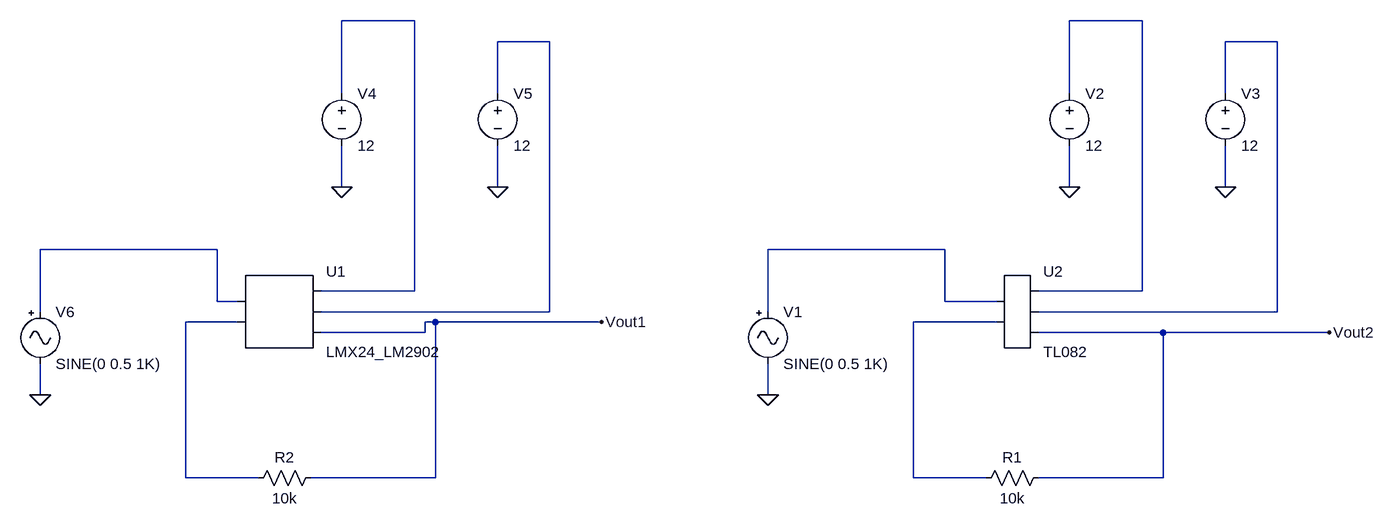
[diagram p0: schematic SimulacaoRelatorio1Parte1.asc]
SimulacaoRelatorio1Parte1.asc, the LTspice schematic file:
Version 4
SHEET 1 1764 680
WIRE 272 -384 160 -384
WIRE 1392 -384 1280 -384
WIRE 480 -352 400 -352
WIRE 1600 -352 1520 -352
WIRE 160 -272 160 -384
WIRE 400 -272 400 -352
WIRE 1280 -272 1280 -384
WIRE 1520 -272 1520 -352
WIRE 160 -128 160 -192
WIRE 400 -128 400 -192
WIRE 1280 -128 1280 -192
WIRE 1520 -128 1520 -192
WIRE -32 -32 -304 -32
WIRE 1088 -32 816 -32
WIRE 272 32 272 -384
WIRE 272 32 128 32
WIRE 1392 32 1392 -384
WIRE 1392 32 1232 32
WIRE -32 48 -32 -32
WIRE 0 48 -32 48
WIRE 1088 48 1088 -32
WIRE 1168 48 1088 48
WIRE -304 64 -304 -32
WIRE 480 64 480 -352
WIRE 480 64 128 64
WIRE 816 64 816 -32
WIRE 1600 64 1600 -352
WIRE 1600 64 1232 64
WIRE 0 80 -80 80
WIRE 304 80 288 80
WIRE 560 80 304 80
WIRE 1168 80 1040 80
WIRE 288 96 288 80
WIRE 288 96 128 96
WIRE 1424 96 1232 96
WIRE 1680 96 1424 96
WIRE -304 192 -304 144
WIRE 816 192 816 144
WIRE -80 320 -80 80
WIRE 32 320 -80 320
WIRE 304 320 304 80
WIRE 304 320 112 320
WIRE 1040 320 1040 80
WIRE 1152 320 1040 320
WIRE 1424 320 1424 96
WIRE 1424 320 1232 320
FLAG -304 192 0
FLAG 400 -128 0
FLAG 160 -128 0
FLAG 560 80 Vout1
FLAG 816 192 0
FLAG 1520 -128 0
FLAG 1280 -128 0
FLAG 1680 96 Vout2
SYMBOL AutoGenerated\\LMX24_LM2902 64 64 R0
SYMATTR InstName U1
SYMBOL voltage 160 -288 R0
SYMATTR InstName V4
SYMATTR Value 12
SYMBOL voltage 400 -288 R0
SYMATTR InstName V5
SYMATTR Value 12
SYMBOL res 128 304 R90
WINDOW 0 0 56 VBottom 2
WINDOW 3 32 56 VTop 2
SYMATTR InstName R2
SYMATTR Value 10k
SYMBOL Misc\\signal -304 48 R0
SYMATTR InstName V6
SYMATTR Value SINE(0 0.5 1K)
SYMBOL voltage 1280 -288 R0
SYMATTR InstName V2
SYMATTR Value 12
SYMBOL voltage 1520 -288 R0
SYMATTR InstName V3
SYMATTR Value 12
SYMBOL res 1248 304 R90
WINDOW 0 0 56 VBottom 2
WINDOW 3 32 56 VTop 2
SYMATTR InstName R1
SYMATTR Value 10k
SYMBOL Misc\\signal 816 48 R0
SYMATTR InstName V1
SYMATTR Value SINE(0 0.5 1K)
SYMBOL AutoGenerated\\TL082 1200 64 R0
SYMATTR InstName U2

The netlist it stands for:
* SimulacaoRelatorio1Parte1.asc
* U1: LMX24_LM2902 (symbol AutoGenerated\LMX24_LM2902 not available, pins judged from their places): pin1=N005 pin2=N007 pin3=N001 pin4=N003 pin5=Vout1
V4 N001 0 12
V5 N003 0 12
R2 Vout1 N007 10k
V6 N005 0 SINE(0 0.5 1K)
V2 N002 0 12
V3 N004 0 12
R1 Vout2 N008 10k
V1 N006 0 SINE(0 0.5 1K)
* U2: TL082 (symbol AutoGenerated\TL082 not available, pins judged from their places): pin1=N006 pin2=N008 pin3=N002 pin4=N004 pin5=Vout2
.backanno
.end